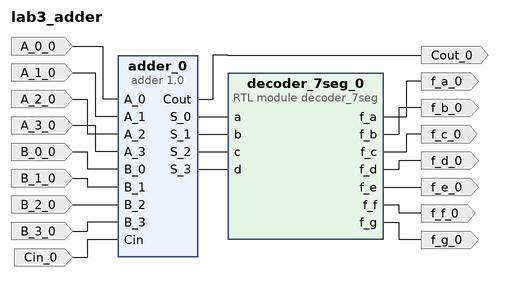
[diagram p0: block diagram of the top level]
# Vivado block design lab3_adder, xc7a35tcpg236-1, Vivado 2018.2
create_bd_design lab3_adder

create_bd_port -dir O f_a_0
create_bd_port -dir O f_b_0
create_bd_port -dir O f_c_0
create_bd_port -dir O f_d_0
create_bd_port -dir O f_e_0
create_bd_port -dir O f_f_0
create_bd_port -dir O f_g_0
create_bd_port -dir I -type data A_0_0
create_bd_port -dir I -type data A_1_0
create_bd_port -dir I -type data A_2_0
create_bd_port -dir I -type data A_3_0
create_bd_port -dir I -type data B_0_0
create_bd_port -dir I -type data B_1_0
create_bd_port -dir I -type data B_2_0
create_bd_port -dir I -type data B_3_0
create_bd_port -dir I -type data Cin_0
create_bd_port -dir O -type data Cout_0

create_bd_cell -type module -reference decoder_7seg decoder_7seg_0
create_bd_cell -type ip -vlnv user.org:user:adder:1.0 adder_0

# ---- connections ----

connect_bd_net [get_bd_pins adder_0/S_0] [get_bd_pins decoder_7seg_0/a]
connect_bd_net [get_bd_pins adder_0/S_1] [get_bd_pins decoder_7seg_0/b]
connect_bd_net [get_bd_pins adder_0/S_2] [get_bd_pins decoder_7seg_0/c]
connect_bd_net [get_bd_pins adder_0/S_3] [get_bd_pins decoder_7seg_0/d]
connect_bd_net [get_bd_pins decoder_7seg_0/f_a] [get_bd_ports f_a_0]
connect_bd_net [get_bd_pins decoder_7seg_0/f_b] [get_bd_ports f_b_0]
connect_bd_net [get_bd_pins decoder_7seg_0/f_c] [get_bd_ports f_c_0]
connect_bd_net [get_bd_pins decoder_7seg_0/f_d] [get_bd_ports f_d_0]
connect_bd_net [get_bd_pins decoder_7seg_0/f_e] [get_bd_ports f_e_0]
connect_bd_net [get_bd_pins decoder_7seg_0/f_f] [get_bd_ports f_f_0]
connect_bd_net [get_bd_pins decoder_7seg_0/f_g] [get_bd_ports f_g_0]
connect_bd_net -net A_0_0_1 [get_bd_ports A_0_0] [get_bd_pins adder_0/A_0]
connect_bd_net -net A_1_0_1 [get_bd_ports A_1_0] [get_bd_pins adder_0/A_1]
connect_bd_net -net A_2_0_1 [get_bd_ports A_2_0] [get_bd_pins adder_0/A_2]
connect_bd_net -net A_3_0_1 [get_bd_ports A_3_0] [get_bd_pins adder_0/A_3]
connect_bd_net -net B_0_0_1 [get_bd_ports B_0_0] [get_bd_pins adder_0/B_0]
connect_bd_net -net B_1_0_1 [get_bd_ports B_1_0] [get_bd_pins adder_0/B_1]
connect_bd_net -net B_2_0_1 [get_bd_ports B_2_0] [get_bd_pins adder_0/B_2]
connect_bd_net -net B_3_0_1 [get_bd_ports B_3_0] [get_bd_pins adder_0/B_3]
connect_bd_net -net Cin_0_1 [get_bd_ports Cin_0] [get_bd_pins adder_0/Cin]
connect_bd_net [get_bd_pins adder_0/Cout] [get_bd_ports Cout_0]

validate_bd_design
save_bd_design
